# Altium project HighPowerMechaduino.PrjPcb
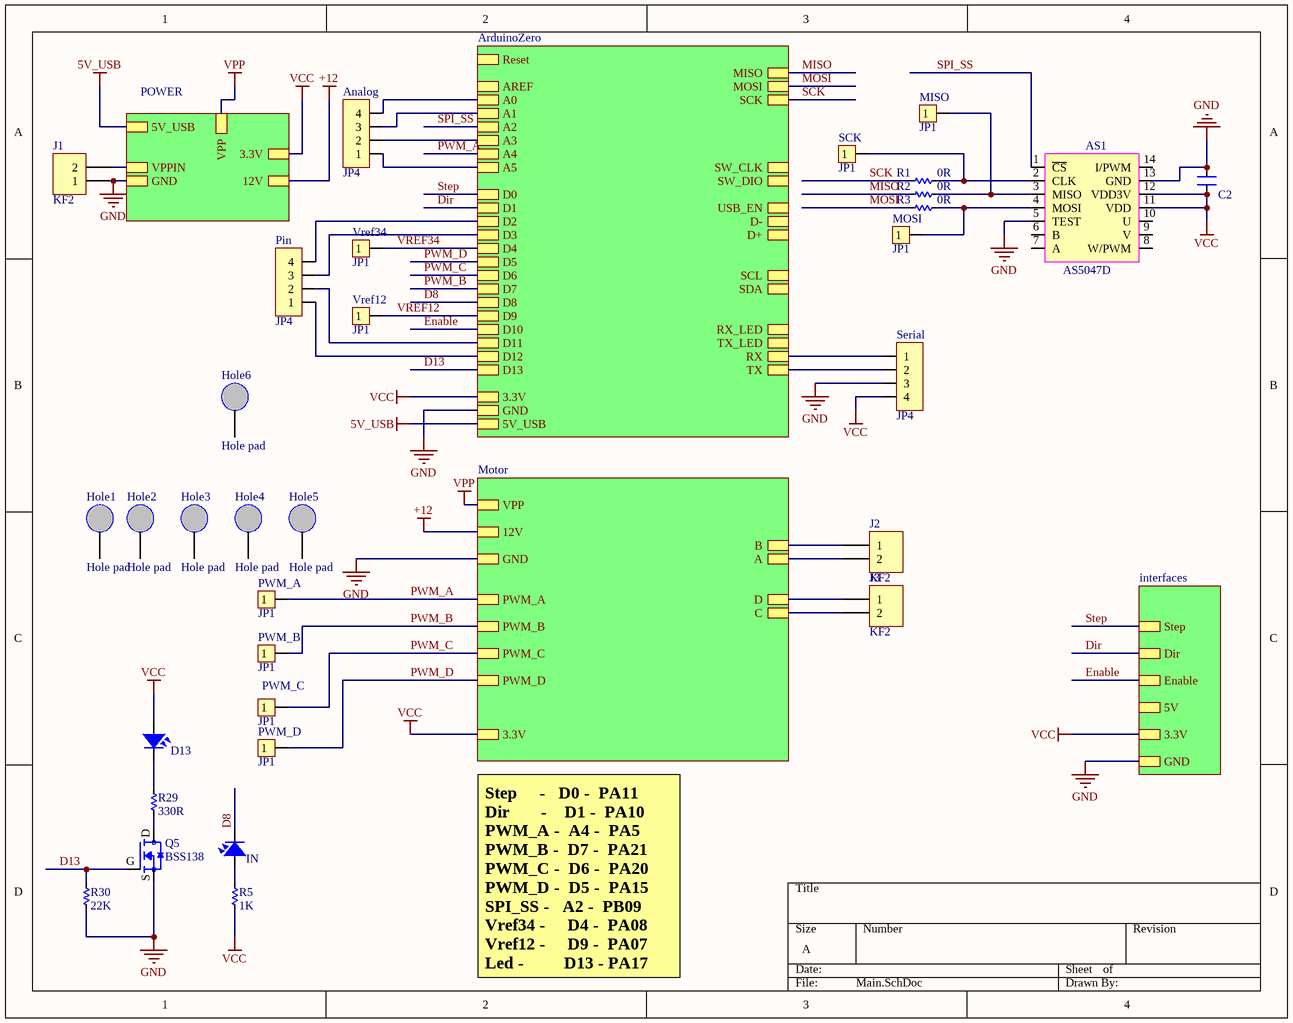
[diagram p0: Main.SchDoc]
5 sheets, 123 parts. Net scope: hierarchical (ports join the sheet entries above them; power ports are global).
Board file: highpower.PcbDoc
Sheets:
  Main.SchDoc
    ArduinoZero = ArduinoZero.SchDoc
    Interfaces = interfaces.SchDoc
    Power = POWER.SchDoc
    Motor = Motor.SchDoc

## Sheet Main.SchDoc
size A

### Parts
Analog  JP4  [JP4-C1T]
AS1  AS5047D  [AS5047D_Module]
C2  CN  [CN-SMD-0603_big]  (value not drawn)
D13  LED  [LED-0805-Blue]  (value not drawn)
Hole1  Hole pad  [HolePad]
Hole2  Hole pad  [HolePad]
Hole3  Hole pad  [HolePad]
Hole4  Hole pad  [HolePad]
Hole5  Hole pad  [HolePad]
Hole6  Hole pad  [HolePad]
IN  LED  [LED-0805-Blue]  (value not drawn)
J1  KF2  [KF2-5.08T]
J2  KF2  [KF2-5.08T]
J3  KF2  [KF2-5.08T]
MISO  JP1  [JP1-D1T]
MOSI  JP1  [JP1-D1T]
Pin  JP4  [JP4-C1T]
PWM_A  JP1  [JP1-D1T]
PWM_B  JP1  [JP1-D1T]
PWM_C  JP1  [JP1-D1T]
PWM_D  JP1  [JP1-D1T]
Q5  BSS138  [SOT23-bss138]
R1  0R  [RES-SMD-0603_BIG]
R2  0R  [RES-SMD-0603_BIG]
R3  0R  [RES-SMD-0603_BIG]
R5  1K  [RES-SMD-0603_BIG]
R29  330R  [RES-SMD-0603_BIG]
R30  22K  [RES-SMD-0603_BIG]
SCK  JP1  [JP1-D1T]
Serial  JP4  [JP4-C1T]
Vref12  JP1  [JP1-D1T]
Vref34  JP1  [JP1-D1T]

### Sub-sheets
ArduinoZero = ArduinoZero: Reset, A0, A1, A2, A3, A4, A5, D0, D1, D2, D3, D4, AREF, D5, D6, D7, D8, D9, D10, D11, D12, D13, TX, RX, TX_LED, RX_LED, SDA, SCL, 3.3V, GND, D+, D-, USB_EN, SW_DIO, SW_CLK, MISO, MOSI, SCK, 5V_USB
Interfaces = interfaces: Step, Dir, Enable, 5V, 3.3V, GND
Motor = Motor: VPP, 12V, GND, A, B, C, D, PWM_B, PWM_A, PWM_C, PWM_D, 3.3V
Power = POWER: 5V_USB, 3.3V, GND, VPPIN, 12V, VPP

### Nets
5V_USB: sheet ArduinoZero/5V_USB, sheet Power/5V_USB
+12: sheet Power/12V, sheet Motor/12V
GND: AS1.5(TEST) AS1.13(GND) C2.2 J1.1 Q5.S R30.1 Serial.3 ; sheet ArduinoZero/GND, sheet Interfaces/GND, sheet Power/GND, sheet Motor/GND
VCC: AS1.11(VDD) AS1.12(VDD3V) C2.1 D13.1 R5.2 Serial.4 ; sheet ArduinoZero/3.3V, sheet Interfaces/3.3V, sheet Power/3.3V, sheet Motor/3.3V
VPP: J1.2 ; sheet Power/VPPIN, sheet Power/VPP, sheet Motor/VPP
D8: IN.2 ; sheet ArduinoZero/D8
D13: Q5.G R30.2 ; sheet ArduinoZero/D13
Dir: sheet ArduinoZero/D1, sheet Interfaces/Dir  [project net D1]
Enable: sheet ArduinoZero/D10, sheet Interfaces/Enable  [project net D10]
MISO: R2.2 ; sheet ArduinoZero/MISO
MOSI: R3.2 ; sheet ArduinoZero/MOSI
PWM_A: PWM_A.1 ; sheet ArduinoZero/A4, sheet Motor/PWM_A
PWM_B: PWM_B.1 ; sheet ArduinoZero/D7, sheet Motor/PWM_B
PWM_C: PWM_C.1 ; sheet ArduinoZero/D6, sheet Motor/PWM_C
PWM_D: PWM_D.1 ; sheet ArduinoZero/D5, sheet Motor/PWM_D
SCK: R1.2 ; sheet ArduinoZero/SCK
SPI_SS: AS1.1(~{CS}) ; sheet ArduinoZero/A2
Step: sheet ArduinoZero/D0, sheet Interfaces/Step  [project net D0]
VREF12: Vref12.1 ; sheet ArduinoZero/D9
VREF34: Vref34.1 ; sheet ArduinoZero/D4
NetAnalog_1: Analog.1 ; sheet ArduinoZero/A5
NetAnalog_2: Analog.2 ; sheet ArduinoZero/A3
NetAnalog_3: Analog.3 ; sheet ArduinoZero/A1
NetAnalog_4: Analog.4 ; sheet ArduinoZero/A0
NetAS1_2: AS1.2(CLK) R1.1 SCK.1
NetAS1_3: AS1.3(MISO) MISO.1 R2.1
NetAS1_4: AS1.4(MOSI) MOSI.1 R3.1
NetC34_2: J2.2 ; sheet Motor/A
NetC36_2: J2.1 ; sheet Motor/B
NetC37_2: J3.2 ; sheet Motor/C
NetC38_2: J3.1 ; sheet Motor/D
NetD13_2: D13.2 R29.1
NetIN_1: IN.1 R5.1
NetPin_1: Pin.1 ; sheet ArduinoZero/D12
NetPin_2: Pin.2 ; sheet ArduinoZero/D11
NetPin_3: Pin.3 ; sheet ArduinoZero/D3
NetPin_4: Pin.4 ; sheet ArduinoZero/D2
NetQ5_D: Q5.D R29.2
NetSerial_1: Serial.1 ; sheet ArduinoZero/RX
NetSerial_2: Serial.2 ; sheet ArduinoZero/TX

Not connected (* = marked no-connect by the designer): AS1 6(B) 7(A) 8(W/PWM) 9(V) 10(U) 14(I/PWM); Hole1 1; Hole2 1; Hole3 1; Hole4 1; Hole5 1; Hole6 1

### Notes on the sheet
- Step     -   D0 -  PA11
  Dir       -    D1 -  PA10
  PWM_A -  A4 -  PA5
  PWM_B -  D7 -  PA21
  PWM_C -  D6 -  PA20
  PWM_D -  D5 -  PA15
  SPI_SS -   A2 -  PB09
  Vref34 -     D4 -  PA08
  Vref12 -     D9 -  PA07
  Led -         D13 - PA17

### Library data of the parts
Analog Pin Serial = JP4: WR-PHD 2.54 mm Angled Socket Header; Manufacturer: W¨¹rth Elektronik eiSos GmbH; partNo: 613004143121; ComponentLink1 Description: Manufacturer; ComponentLink2 Description: Datasheet; NoPins: 04; Created Date: 29 March 2013; ComponentLink1URL: http://www.we-online.com; ComponentLink2URL: http://katalog.we-online.de/em/datasheet/6130xx143121.pdf; Created by: Karrer Zheng
AS1 = AS5047D: Manufacture_Parts: :AS5047D; ID: 37; Misfit Price: 0; Vendor: unknown; Voltage_Str: 0V; Watts_Str: 0W; Current_Str: A; Company_Part_GUID: altiumdb5786b44c08eb91.84503477; Component: AS5047D; Manufacturer_Part_Number: AS5047D; ComponentLink1Description: unknown; ComponentLink2Description: Datasheet; Voltage: 0; Watts: 0; Price: 0
C2 = CN: Value: 33pF
D13 IN = LED SMD: Value: LED 3 - 5 ly 2 Colour
J1-J3 = KF2: Manufacturer: Würth Elektronik eiSos GmbH; partNo: 691103110002; ComponentLink1 Description: Manufacturer; ComponentLink2 Description: Datasheet; NoPins: 2; Created Date: 29 October 2013; ComponentLink1URL: http://www.we-online.com; ComponentLink2URL: http://katalog.we-online.de/em/datasheet/6911031100xx.pdf; Created by: Karrer Zheng
MISO MOSI PWM_A PWM_B PWM_C PWM_D SCK Vref12 Vref34 = JP1: WR-PHD 2.54 mm Angled Socket Header; Manufacturer: W¨¹rth Elektronik eiSos GmbH; partNo: 613002143121; ComponentLink1 Description: Manufacturer; ComponentLink2 Description: Datasheet; NoPins: 02; Created Date: 29 March 2013; ComponentLink1URL: http://www.we-online.com; ComponentLink2URL: http://katalog.we-online.de/em/datasheet/6130xx143121.pdf; Created by: Karrer Zheng
Q5 = BSS138: N-Channel 50V 220mA _Ta_ 360mW _Ta_ Surface Mount Die; MF: MICROSS/On Semiconductor; Value: *; SnapEDA_Link: https://www.snapeda.com/parts/BSS138/MICROSS/On%20Semiconductor/view-part/2773844/?ref=snap; MP: BSS138; Availability: Unavailable; Price: None; Package: TO-236-3 Micross
R1-R3 R5 R29 R30 = R

## Sheet ArduinoZero.SchDoc
size A
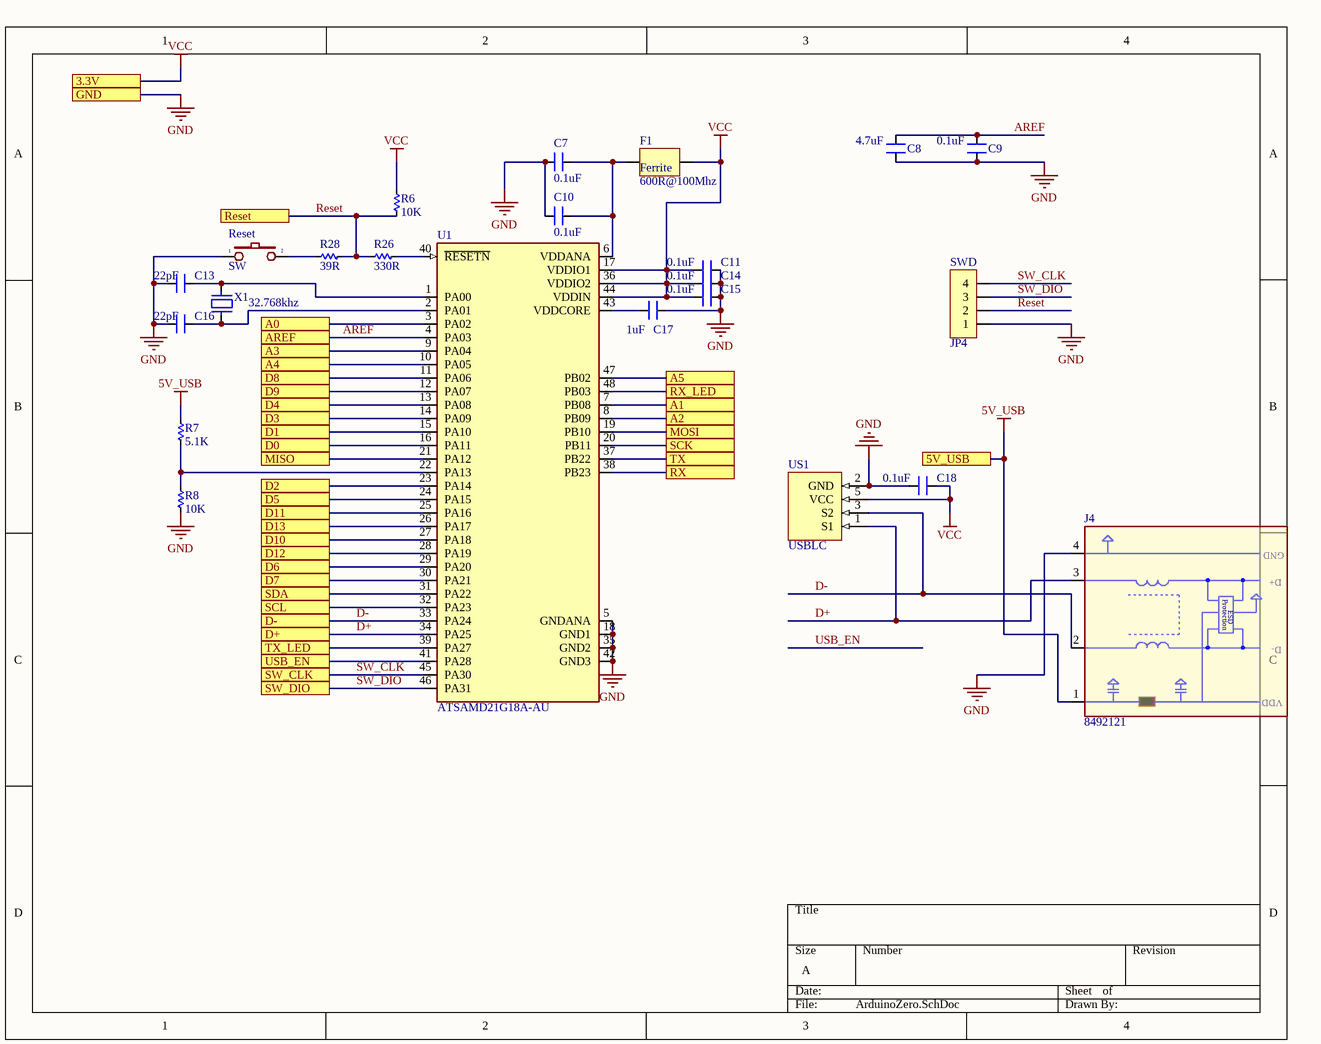
[diagram p1: ArduinoZero.SchDoc]

### Parts
C7  0.1uF  [CN-SMD-0603_big]
C8  4.7uF  [CN-SMD-0603_big]
C9  0.1uF  [CN-SMD-0603_big]
C10  0.1uF  [CN-SMD-0603_big]
C11  0.1uF  [CN-SMD-0603_big]
C13  22pF  [CN-SMD-0603_big]
C14  0.1uF  [CN-SMD-0603_big]
C15  0.1uF  [CN-SMD-0603_big]
C16  22pF  [CN-SMD-0603_big]
C17  1uF  [CN-SMD-0603_big]
C18  0.1uF  [CN-SMD-0603_big]
F1  600R@100Mhz  [Capacitor_805]
J4  8492121  [USB-C3]
R6  10K  [RES-SMD-0603_BIG]
R7  5.1K  [RES-SMD-0603_BIG]
R8  10K  [RES-SMD-0603_BIG]
R26  330R  [RES-SMD-0603_BIG]
R28  39R  [RES-SMD-0603_BIG]
Reset  SW  [SW1-SMD]
SWD  JP4  [JP4-D1C]
U1  ATSAMD21G18A-AU  [QFP50P900X900X120-48N]
US1  USBLC  [SOT23-6]
X1  32.768khz  [XT32k]

### Ports
3.3V, 5V_USB, A0, A1, A2, A3, A4, A5, AREF, D0, D1, D2, D3, D4, D5, D6, D7, D8, D9, D10, D11, D12, D13, D+, D-, GND, MISO, MOSI, Reset, RX, RX_LED, SCK, SCL, SDA, SW_CLK, SW_DIO, TX, TX_LED, USB_EN

### Nets
5V_USB: J4.1(VBUS) R7.1 ; port 5V_USB
GND: C7.2 C8.1 C9.1 C10.2 C11.2 C13.1 C14.2 C15.2 C16.1 C17.2 C18.1 J4.4(GND) R8.2 Reset.1 SWD.1 U1.5(GNDANA) U1.18(GND1) U1.35(GND2) U1.42(GND3) US1.2(GND) ; port GND
VCC: C11.1 C14.1 C15.1 C18.2 F1.2 R6.1 U1.17(VDDIO1) U1.36(VDDIO2) U1.44(VDDIN) US1.5(VCC) ; port 3.3V
AREF: C8.2 C9.2 U1.4(PA03) ; port AREF
D0: U1.16(PA11) ; port D0
D1: U1.15(PA10) ; port D1
D8: U1.11(PA06) ; port D8
D10: U1.27(PA18) ; port D10
D13: U1.26(PA17) ; port D13
D+: J4.3(D+) U1.34(PA25) US1.1(S1) ; port D+
D-: J4.2(D-) U1.33(PA24) US1.3(S2) ; port D-
MISO: U1.21(PA12) ; port MISO
MOSI: U1.19(PB10) ; port MOSI
PWM_A: U1.10(PA05) ; port A4
PWM_B: U1.30(PA21) ; port D7
PWM_C: U1.29(PA20) ; port D6
PWM_D: U1.24(PA15) ; port D5
Reset: R6.2 R26.1 R28.2 SWD.2 ; port Reset
SCK: U1.20(PB11) ; port SCK
SPI_SS: U1.8(PB09) ; port A2
SW_CLK: SWD.4 U1.45(PA30) ; port SW_CLK
SW_DIO: SWD.3 U1.46(PA31) ; port SW_DIO
VREF12: U1.12(PA07) ; port D9
VREF34: U1.13(PA08) ; port D4
NetAnalog_1: U1.47(PB02) ; port A5
NetAnalog_2: U1.9(PA04) ; port A3
NetAnalog_3: U1.7(PB08) ; port A1
NetAnalog_4: U1.3(PA02) ; port A0
NetC7_1: C7.1 C10.1 F1.1 U1.6(VDDANA)
NetC13_2: C13.2 U1.1(PA00) X1.2
NetC16_2: C16.2 U1.2(PA01) X1.1
NetC17_1: C17.1 U1.43(VDDCORE)
NetPin_1: U1.28(PA19) ; port D12
NetPin_2: U1.25(PA16) ; port D11
NetPin_3: U1.14(PA09) ; port D3
NetPin_4: U1.23(PA14) ; port D2
NetR7_2: R7.2 R8.1 U1.22(PA13)
NetR26_2: R26.2 U1.40(~{RESETN})
NetR28_1: R28.1 Reset.2
NetSerial_1: U1.38(PB23) ; port RX
NetSerial_2: U1.37(PB22) ; port TX
NetU1_31: U1.31(PA22) ; port SDA
NetU1_32: U1.32(PA23) ; port SCL
NetU1_39: U1.39(PA27) ; port TX_LED
NetU1_41: U1.41(PA28) ; port USB_EN
NetU1_48: U1.48(PB03) ; port RX_LED

### Notes on the sheet
- (in symbol USB-4) Protection; ESD; VDD

### Library data of the parts
C7-C11 C13-C18 = CN: Value: 33pF
F1 = Ferrite
J4 = USB-4: THT USB 2.0 A Connector WE-EPLE; Manufacturer: Würth Elektronik eiSos GmbH; PartNo: 8492121; ComponentLink1Description: Manufacturer; ComponentLink1URL: http://www.we-online.de; Created by: Christin Otto; Created Date: OCT-2014; ComponentLink2Description: Datasheet; ComponentLink2URL: http://www.we-online.de/katalog/media/pdf/8492121.pdf
R6-R8 R26 R28 = R
Reset = SW2: Switch button 2 pin; Value: SW chip 2 pin
SWD = JP4: as Analog on sheet Main; Created Date: 29 March 2013; ComponentLink1URL: http://www.we-online.com; ComponentLink2URL: http://katalog.we-online.de/em/datasheet/6130xx143121.pdf; Created by: Karrer Zheng
U1 = ATSAMD21G18A-AU: ARMÂ® CortexÂ®-M0+ SAM D21G Microcontroller IC 32-Bit 48MHz 256KB _256K x 8_ FLASH 48-TQFP _7x7_ / Arduino Zero; MF: Microchip; MP: ATSAMD21G18A-AU; Price: None; Package: TQFP-48 Atmel; Value: *; Availability: Unavailable; SnapEDA_Link: https://www.snapeda.com/parts/ATSAMD21G18A-AU/Microchip/view-part/55502/?ref=snap
US1 = USBLC6-2S: http://robocon.vn/detail/ic81-ic-dan-ul26-usblc6-2sc6-sot-23-6-st-st-esd.html
X1 = XT2: Crystal, 32.768 KHz, -40 to 85 degC, 3.2 x 1.5 x 0.9 mm SMD; Value: 4Mhz

## Sheet interfaces.SchDoc
size A4
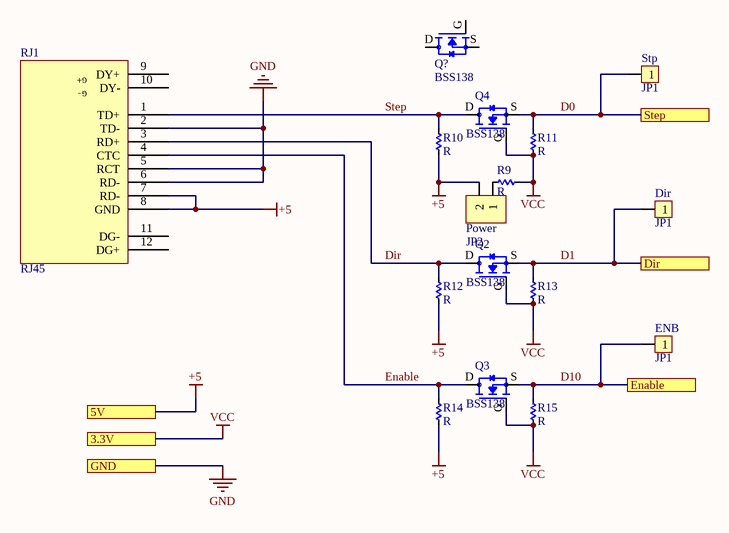
[diagram p2: interfaces.SchDoc]

### Parts
Dir  JP1  [JP1-D1T]
ENB  JP1  [JP1-D1T]
Power  JP2  [JP2-CLOSED]
Q2  BSS138  [SOT23-bss138]
Q3  BSS138  [SOT23-bss138]
Q4  BSS138  [SOT23-bss138]
Q?  BSS138  [SOT23-bss138]
R9  R  [RES-SMD-0603_BIG]
R10  R  [RES-SMD-0603_BIG]
R11  R  [RES-SMD-0603_BIG]
R12  R  [RES-SMD-0603_BIG]
R13  R  [RES-SMD-0603_BIG]
R14  R  [RES-SMD-0603_BIG]
R15  R  [RES-SMD-0603_BIG]
RJ1  RJ45  [RJ45-Dung]
Stp  JP1  [JP1-D1T]

### Ports
3.3V, 5V, Dir, Enable, GND, Step

### Nets
+5: Power.2 R10.2 R12.2 R14.2 RJ1.7(RD-) RJ1.8(GND) ; port 5V
GND: RJ1.2(TD-) RJ1.5(RCT) RJ1.6(RD-) ; port GND
VCC: Q2.G Q3.G Q4.G R9.2 R11.2 R13.2 R15.2 ; port 3.3V
D0: Q4.S R11.1 Stp.1 ; port Step
D1: Dir.1 Q2.S R13.1 ; port Dir
D10: ENB.1 Q3.S R15.1 ; port Enable
Dir: Q2.D R12.1 RJ1.3(RD+)
Enable: Q3.D R14.1 RJ1.4(CTC)
Step: Q4.D R10.1 RJ1.1(TD+)
NetPower_1: Power.1 R9.1

Not connected (* = marked no-connect by the designer): Q? D G S; RJ1 9(DY+) 10(DY-) 11(DG-) 12(DG+)

### Notes on the sheet
- (in symbol CON JR45) G+; G-

### Library data of the parts
Dir ENB Stp = JP1: as MISO on sheet Main; Created Date: 29 March 2013; ComponentLink1URL: http://www.we-online.com; ComponentLink2URL: http://katalog.we-online.de/em/datasheet/6130xx143121.pdf; Created by: Karrer Zheng
Power = JP2: WR-PHD 2.54 mm Angled Socket Header; Manufacturer: W¨¹rth Elektronik eiSos GmbH; partNo: 613002143121; ComponentLink1 Description: Manufacturer; ComponentLink2 Description: Datasheet; NoPins: 02; Created Date: 29 March 2013; ComponentLink1URL: http://www.we-online.com; ComponentLink2URL: http://katalog.we-online.de/em/datasheet/6130xx143121.pdf; Created by: Karrer Zheng
Q2-Q4 Q? = BSS138: as Q5 on sheet Main; Value: *; SnapEDA_Link: https://www.snapeda.com/parts/BSS138/MICROSS/On%20Semiconductor/view-part/2773844/?ref=snap; MP: BSS138; Availability: Unavailable; Price: None; Package: TO-236-3 Micross
RJ1 = CON JR45: ComponentLink1Description: Mua; ComponentLink1URL: https://thegioiic.com/products/rj45-top-cong-rj45-top-180-do

## Sheet POWER.SchDoc
size A4
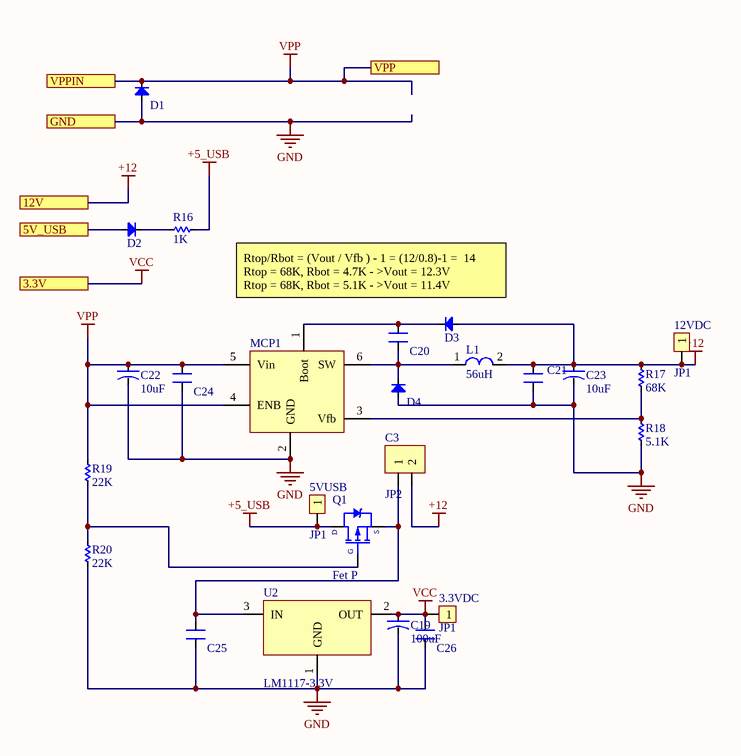
[diagram p3: POWER.SchDoc]

### Parts
3.3VDC  JP1  [JP1-D1T]
5VUSB  JP1  [JP1-D1T]
12VDC  JP1  [JP1-D1T]
C3  JP2  [JP2-CLOSED]
C19  100uF  [CAP-ALU-SMD-D]
C20  CN  [CN-SMD-0603_big]  (value not drawn)
C21  CN  [CN-SMD-0603_big]  (value not drawn)
C22  10uF  [CAP-ALU-SMD-6.3x7.7x2.2]
C23  10uF  [CAP-ALU-SMD-6.3x7.7x2.2]
C24  CN  [CN-SMD-0603_big]  (value not drawn)
C25  CN  [CN-SMD-0603_big]  (value not drawn)
C26  CN  [CN-SMD-0603_big]  (value not drawn)
D1  RB160M-60  [DIO-SMD-214AC]  (value not drawn)
D2  Diode  [DIO-SMD-123]  (value not drawn)
D3  Diode  [DIO-SMD-123]  (value not drawn)
D4  Diode  [DIO-SMD-123]  (value not drawn)
L1  56uH  [L_SMD]
MCP1  MCP16331  [SOT23-6-]  (value not drawn)
Q1  Fet P  [SOT23F]
R16  1K  [RES-SMD-0603_BIG]
R17  68K  [RES-SMD-0603_BIG]
R18  5.1K  [RES-SMD-0603_BIG]
R19  22K  [RES-SMD-0603_BIG]
R20  22K  [RES-SMD-0603_BIG]
U2  LM1117-3.3V  [SOT223]

### Ports
3.3V, 5V_USB, 12V, GND, VPP, VPPIN

### Nets
5V_USB: D2.1(A) ; port 5V_USB
+5_USB: 5VUSB.1 Q1.3(D) R16.2
+12: 12VDC.1 C3.2 C21.2 C23.1 D3.1(A) L1.2 R17.1 ; port 12V
GND: C19.2 C21.1 C22.2 C23.2 C24.1 C25.1 C26.1 D1.1(A) D4.1(A) MCP1.2(GND) R18.2 R20.2 U2.1(GND) ; port GND
VCC: 3.3VDC.1 C19.1 C26.2 U2.2(OUT) ; port 3.3V
VPP: C22.1 C24.2 D1.2(K) MCP1.4(ENB) MCP1.5(Vin) R19.1 ; port VPPIN, port VPP
NetC3_1: C3.1 C25.2 Q1.2(S) U2.3(IN)
NetC20_1: C20.1 D4.2(K) L1.1 MCP1.6(SW)
NetC20_2: C20.2 D3.2(K) MCP1.1(Boot)
NetD2_2: D2.2(K) R16.1
NetMCP1_3: MCP1.3(Vfb) R17.2 R18.1
NetQ1_1: Q1.1(G) R19.2 R20.1

### Notes on the sheet
- Rtop/Rbot = (Vout / Vfb ) - 1 = (12/0.8)-1 =  14
  Rtop = 68K, Rbot = 4.7K - >Vout = 12.3V
  Rtop = 68K, Rbot = 5.1K - >Vout = 11.4V

### Library data of the parts
3.3VDC 5VUSB 12VDC = JP1: as MISO on sheet Main; Created Date: 29 March 2013; ComponentLink1URL: http://www.we-online.com; ComponentLink2URL: http://katalog.we-online.de/em/datasheet/6130xx143121.pdf; Created by: Karrer Zheng
C3 = JP2: as Power on sheet interfaces; Created Date: 29 March 2013; ComponentLink1URL: http://www.we-online.com; ComponentLink2URL: http://katalog.we-online.de/em/datasheet/6130xx143121.pdf; Created by: Karrer Zheng
C19 C22 C23 = CN-ALU-SMD: Polarized Capacitor (Axial); Published: 8-Jun-2000; LatestRevisionDate: 17-Jul-2002; LatestRevisionNote: Re-released for DXP Platform.; PackageReference: POLAR0.8; Publisher: Altium Limited
C20 C21 C24-C26 = CN: Value: 33pF
D1-D4 = Diode: Default Diode; Code - JEDEC: DO-214-AB; Value: 1N5007; Published: 8-Jun-2000; Revision: July-2002: Re-released for DXP Platform.; Publisher: Altium Limited; ComponentLink1Description: ES1J - STMBL; ComponentLink1URL: https://banlinhkien.vn/goods-8089-es1j-do214-diode-1a-600v-sma-es1j-.html
  D1: ComponentLink2Description: Schottky; ComponentLink2URL: RB160M-60
L1 = L-SMD-1: https://www.thegioiic.com/products/cuon-cam-68uh-cd75-smd-7-8x7-5x5-0; partNo: 78477010; Manufacturer: Wurth Elektronik; Inductance: 56 μH; ComponentLink1Description: Manufacturer; ComponentLink1URL: http://www.we-online.de; Created by: Baojun Chen; Created Date: Nov.2015; ComponentLink2Description: Datasheet; ComponentLink2URL: http://katalog.we-online.de/pbs/datasheet/78477010.pdf
Q1 = Fet P: HEXFET P-Channel Power MOSFET; Value: IRF840
R16-R20 = R
U2 = LM1117: 800mA Low-Dropout Linear Regulator; Creator: Nguyen Ba Bien; Website: http://group3i.net

## Sheet Motor.SchDoc
size A4
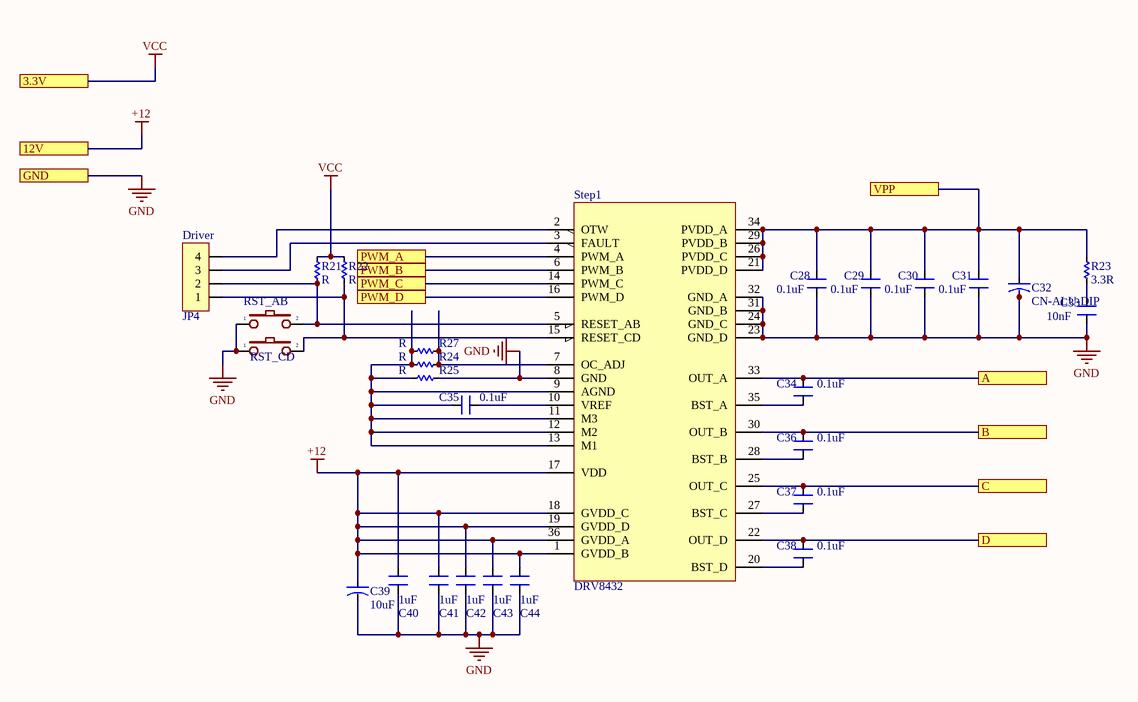
[diagram p4: Motor.SchDoc]

### Parts
C28  0.1uF  [CN-SMD-0603_big]
C29  0.1uF  [CN-SMD-0603_big]
C30  0.1uF  [CN-SMD-0603_big]
C31  0.1uF  [CN-SMD-0603_big]
C32  CN-ALU-DIP  [CA-ALU-5R]
C33  10nF  [CN-SMD-0603_big]
C34  0.1uF  [CN-SMD-0805]
C35  0.1uF  [CN-SMD-0603_big]
C36  0.1uF  [CN-SMD-0603_big]
C37  0.1uF  [CN-SMD-0603_big]
C38  0.1uF  [CN-SMD-0805]
C39  10uF  [CAP-ALU-SMD-6.3x7.7x2.2]
C40  1uF  [CN-SMD-0603_big]
C41  1uF  [CN-SMD-0603_big]
C42  1uF  [CN-SMD-0603_big]
C43  1uF  [CN-SMD-0603_big]
C44  1uF  [CN-SMD-0603_big]
Driver  JP4  [JP4-C1T]
R21  R  [RES-SMD-0603_BIG]
R22  R  [RES-SMD-0603_BIG]
R23  3.3R  [RES-SMD-0603_BIG]
R24  R  [RES-SMD-0603_BIG]
R25  R  [RES-SMD-0603_BIG]
R27  R  [RES-SMD-0603_BIG]
RST_AB  SW  [SW1-SMD]  (value not drawn)
RST_CD  SW  [SW1-SMD]  (value not drawn)
Step1  DRV8432  [DRV8432]  (net tie)

### Ports
3.3V, 12V, A, B, C, D, GND, PWM_A, PWM_B, PWM_C, PWM_D, VPP

### Nets
+12: C39.1 C40.2 C41.2 C42.2 C43.2 C44.2 Step1.1(GVDD_B) Step1.17(VDD) Step1.18(GVDD_C) Step1.19(GVDD_D) Step1.36(GVDD_A) ; port 12V
GND: C28.1 C29.1 C30.1 C31.1 C32.2 C33.1 C39.2 C40.1 C41.1 C42.1 C43.1 C44.1 R25.1 RST_AB.1 RST_CD.1 Step1.8(GND) Step1.23(GND_D) Step1.24(GND_C) Step1.31(GND_B) Step1.32(GND_A) ; port GND
VCC: R21.1 R22.1 ; port 3.3V
VPP: C28.2 C29.2 C30.2 C31.2 C32.1 R23.1 Step1.21(PVDD_D) Step1.26(PVDD_C) Step1.29(PVDD_B) Step1.34(PVDD_A) ; port VPP
PWM_A: Step1.4(PWM_A) ; port PWM_A
PWM_B: Step1.6(PWM_B) ; port PWM_B
PWM_C: Step1.14(PWM_C) ; port PWM_C
PWM_D: Step1.16(PWM_D) ; port PWM_D
NetC33_2: C33.2 R23.2
NetC34_1: C34.1 Step1.35(BST_A)
NetC34_2: C34.2 Step1.33(OUT_A) ; port A
NetC35_1: C35.1 Step1.10(VREF)
NetC35_2: C35.2 R24.2 R25.2 R27.2 Step1.9(AGND) Step1.11(M3) Step1.12(M2) Step1.13(M1)
NetC36_1: C36.1 Step1.28(BST_B)
NetC36_2: C36.2 Step1.30(OUT_B) ; port B
NetC37_1: C37.1 Step1.27(BST_C)
NetC37_2: C37.2 Step1.25(OUT_C) ; port C
NetC38_1: C38.1 Step1.20(BST_D)
NetC38_2: C38.2 Step1.22(OUT_D) ; port D
NetDriver_1: Driver.1 R22.2 RST_CD.2 Step1.15(RESET_CD)
NetDriver_2: Driver.2 R21.2 RST_AB.2 Step1.5(RESET_AB)
NetDriver_3: Driver.3 Step1.3(FAULT)
NetDriver_4: Driver.4 Step1.2(OTW)
NetR24_1: R24.1 R27.1 Step1.7(OC_ADJ)

### Library data of the parts
C28-C31 C33-C38 C40-C44 = CN: Value: 33pF
C32 = CN-ALU-DIP: Capacitor (Semiconductor SIM Model); Value: 104; LatestRevisionDate: 17-Jul-2002; LatestRevisionNote: Re-released for DXP Platform.; PackageReference: C1206; Publisher: Altium Limited
C39 = CN-ALU-SMD: Polarized Capacitor (Axial); Published: 8-Jun-2000; LatestRevisionDate: 17-Jul-2002; LatestRevisionNote: Re-released for DXP Platform.; PackageReference: POLAR0.8; Publisher: Altium Limited
Driver = JP4: as Analog on sheet Main; Created Date: 29 March 2013; ComponentLink1URL: http://www.we-online.com; ComponentLink2URL: http://katalog.we-online.de/em/datasheet/6130xx143121.pdf; Created by: Karrer Zheng
R23 = R
RST_AB RST_CD = SW2: as Reset on sheet ArduinoZero
Step1 = DRV8432: https://www.digikey.com/product-detail/en/texas-instruments/DRV8432DKDR/296-29573-2-ND/2353367; ComponentLink1Description: Datasheet; ComponentLink1URL: https://www.ti.com/lit/ds/symlink/drv8432.pdf; ComponentLink2Description: BOM; ComponentLink2URL: https://www.digikey.com/product-detail/en/texas-instruments/DRV8432DKDR/296-29573-2-ND/2353367

## Nets that join several sheets
5V_USB: ArduinoZero (J4.1 R7.1), POWER (D2.1)
+12: POWER (7 pins), Motor (11 pins)
GND: Main (7 pins), ArduinoZero (20 pins), interfaces (RJ1.2 RJ1.5 RJ1.6), POWER (13 pins), Motor (20 pins)
VCC: Main (6 pins), ArduinoZero (10 pins), interfaces (7 pins), POWER (3.3VDC.1 C19.1 C26.2 U2.2), Motor (R21.1 R22.1)
VPP: Main (J1.2), POWER (6 pins), Motor (10 pins)
D0: ArduinoZero (U1.16), interfaces (Q4.S R11.1 Stp.1)
D1: ArduinoZero (U1.15), interfaces (Dir.1 Q2.S R13.1)
D8: Main (IN.2), ArduinoZero (U1.11)
D10: ArduinoZero (U1.27), interfaces (ENB.1 Q3.S R15.1)
D13: Main (Q5.G R30.2), ArduinoZero (U1.26)
MISO: Main (R2.2), ArduinoZero (U1.21)
MOSI: Main (R3.2), ArduinoZero (U1.19)
NetAnalog_1: Main (Analog.1), ArduinoZero (U1.47)
NetAnalog_2: Main (Analog.2), ArduinoZero (U1.9)
NetAnalog_3: Main (Analog.3), ArduinoZero (U1.7)
NetAnalog_4: Main (Analog.4), ArduinoZero (U1.3)
NetC34_2: Main (J2.2), Motor (C34.2 Step1.33)
NetC36_2: Main (J2.1), Motor (C36.2 Step1.30)
NetC37_2: Main (J3.2), Motor (C37.2 Step1.25)
NetC38_2: Main (J3.1), Motor (C38.2 Step1.22)
NetPin_1: Main (Pin.1), ArduinoZero (U1.28)
NetPin_2: Main (Pin.2), ArduinoZero (U1.25)
NetPin_3: Main (Pin.3), ArduinoZero (U1.14)
NetPin_4: Main (Pin.4), ArduinoZero (U1.23)
NetSerial_1: Main (Serial.1), ArduinoZero (U1.38)
NetSerial_2: Main (Serial.2), ArduinoZero (U1.37)
PWM_A: Main (PWM_A.1), ArduinoZero (U1.10), Motor (Step1.4)
PWM_B: Main (PWM_B.1), ArduinoZero (U1.30), Motor (Step1.6)
PWM_C: Main (PWM_C.1), ArduinoZero (U1.29), Motor (Step1.14)
PWM_D: Main (PWM_D.1), ArduinoZero (U1.24), Motor (Step1.16)
SCK: Main (R1.2), ArduinoZero (U1.20)
SPI_SS: Main (AS1.1), ArduinoZero (U1.8)
VREF12: Main (Vref12.1), ArduinoZero (U1.12)
VREF34: Main (Vref34.1), ArduinoZero (U1.13)